# Altium project TSAL_REV1.PrjPCB
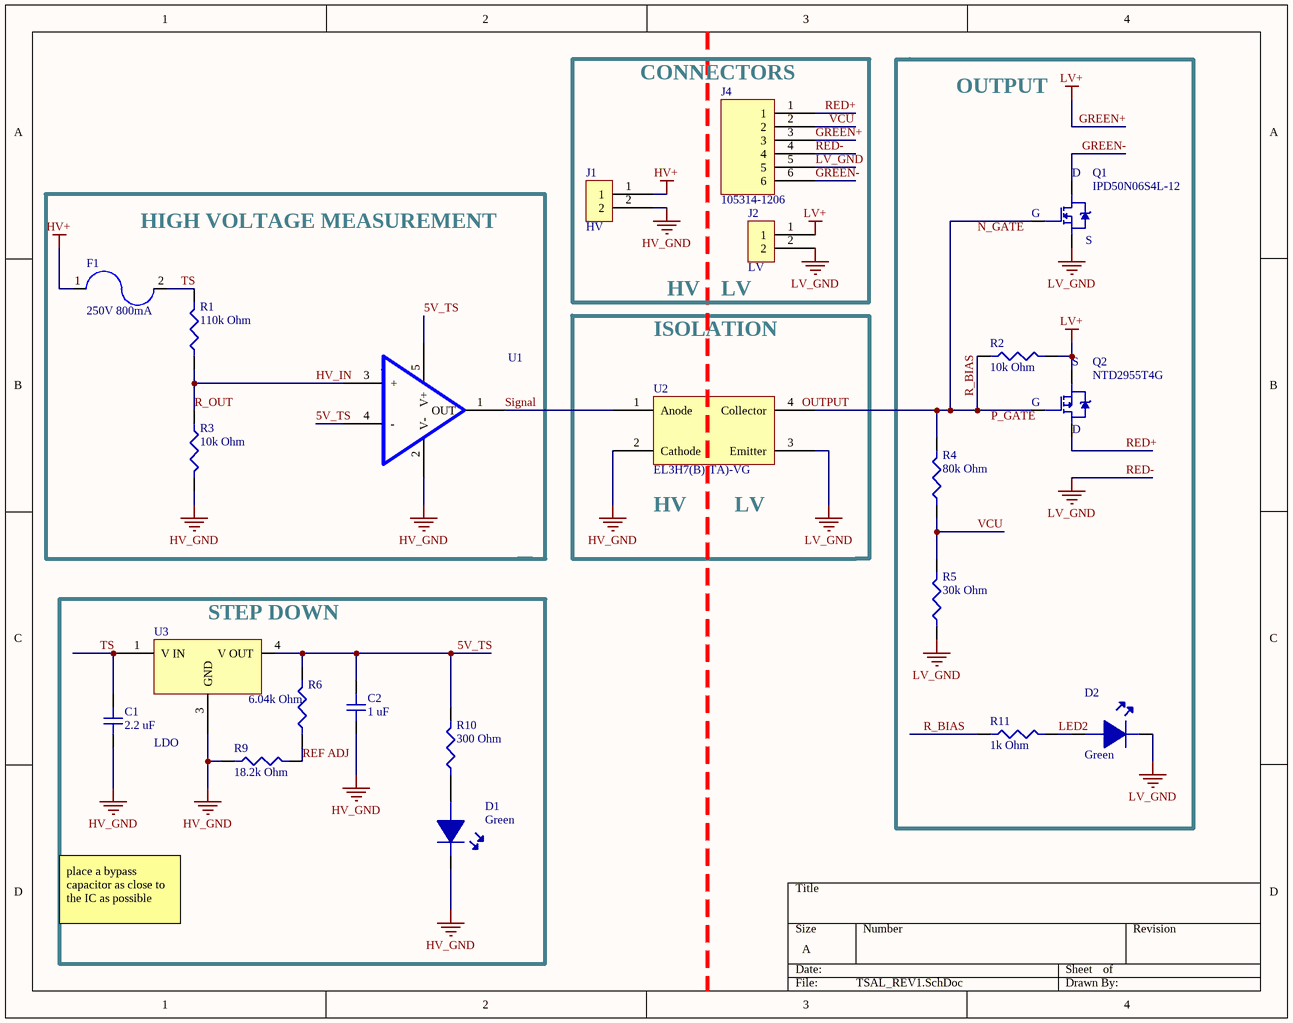
[diagram p0: TSAL_REV1.SchDoc]
1 sheet, 22 parts. Net scope: global (net labels, ports and power ports of the same name join across sheets).
Board file: TSAL_REV1_PCB.PcbDoc

## Sheet TSAL_REV1.SchDoc
size A

### Parts
C1  2.2 uF  [CAPC5850X25N]
C2  1 uF
D1  Green  [LED_0603]
D2  Green  [LED_0603]
F1  250V 800mA  [FUSE_SMD]
J1  HV  [2_PIN_CONNECTOR]
J2  LV  [2_PIN_CONNECTOR]
J4  105314-1206  [*MOLEX_1053141206]
Q1  IPD50N06S4L-12  [DPAK228P998X235-3N]
Q2  NTD2955T4G  [DPAK228P991X238-3N]
R1  110k Ohm  [RESC3116X06N]
R2  10k Ohm  [RESC2012X06N]
R3  10k Ohm  [RESC2012X06N]
R4  80k Ohm  [RESC1608X06N]
R5  30k Ohm  [RESC2012X06N]
R6  6.04k Ohm  [RESC2012X06N]
R9  18.2k Ohm  [RESC2012X06N]
R10  300 Ohm  [RESC1608X06N]
R11  1k Ohm  [RESC1608X06N]
U1  TS861ILT  [SOT95P280X145-5N]  (value not drawn)
U2  EL3H7(B)(TA)-VG  [SOIC127P700X200-4N]
U3  LDO  [DPAK228P991X238-3N]

### Blocks framed on the sheet
OUTPUT: D2 Q1 Q2 R2 R4 R5 R11
STEP DOWN: C1 C2 D1 R6 R9 R10 U3

### Nets
GREEN+: J2.1 J4.3 Q2.4 R2.2  [also labelled LV+]
HV+: F1.1 J1.1
HV_GND: C1.1 C2.1 D1.2 J1.2 R3.2 R9.1 U1.2(V-) U2.2(Cathode) U3.3(GND)
LV_GND: D2.2 J2.2 J4.4 J4.5 Q1.3 R5.1 U2.3(Emitter)  [also labelled RED-]
5V_TS: C2.2 R6.2 R10.2 U1.4(-) U1.5(V+) U3.4(V_OUT)
GREEN-: J4.6 Q1.4
HV_IN: R1.1 R3.1 U1.3(+)  [also labelled R_OUT]
LED2: D2.1 R11.2
R_BIAS: Q1.1 Q2.1 R2.1 R4.2 R11.1 U2.4(Collector)
RED+: J4.1 Q2.3
REF ADJ: R6.1 R9.2
Signal: U1.1(OUT) U2.1(Anode)
TS: C1.2 F1.2 R1.2 U3.1(V_IN)
VCU: J4.2 R4.1 R5.2
NetD1_1: D1.1 R10.1

### Notes on the sheet
- (near J4) CONNECTORS
- HIGH VOLTAGE MEASUREMENT
- HV
- (near J2) LV
- ISOLATION
- (near U2) HV
- (near U2) LV
- place a bypass capacitor as close to the IC as possible
- Labels drawn without touching a wire or pin: N_GATE, OUTPUT, P_GATE
- (in symbol IPD50N06S4L-12) D; G; S
- (in symbol NTD2955T4G) S; G; D

### Library data of the parts
C1 = CGA9P3X7T2E225K250KE: CAP CER 2.2UF 250V X7T 2220; Manufacturer: TDK; Tolerance: 10%; Supplier 1: Digi-Key; Manufacturer Part Number: CGA9P3X7T2E225K250KE; Stock 1: 26264; Pricing 1: 1=4.7, 10=4.227, 100=3.1935 (USD); Mount: Surface Mount; Case/Package: 2220; Weight: 0.016932oz; Case Code (Imperial): 2220; Case Code (Metric): 5750; Min Operating Temperature: -55°C; Max Operating Temperature: 125°C; Capacitance: 2.2uF; Voltage Rating (DC): 250V; Packaging: Tape and Reel; Package Quantity: 1; Voltage Rating: 250V; Dielectric: X7T; Termination: SMD/SMT; Features: Soft Termination; Length: 5.7mm; Height: 2.5mm; Width: 5mm; Thickness: 0.11inch; Depth: 5mm; Ratings: AEC-Q200; REACH SVHC: No SVHC; Lead Free: Lead Free; ComponentLink1URL: http://www.mouser.com/ds/2/400/lcc_commercial_soft_en-775842.pdf?src-supplier=Mouser; ComponentLink1Description: http://www.mouser.com/ds/2/400/lcc_commercial_soft_en-775842.pdf?src-supplier=Mouser; ComponentLink2URL: http://www.farnell.com/datasheets/1839935.pdf?src-supplier=Element14; ComponentLink2Description: http://www.farnell.com/datasheets/1839935.pdf?src-supplier=Element14; Supplier Part Number 1: 445-8766-1-ND
C2 = CL10A105KP8NNNC: Cap Ceramic 1uF 10V X5R 10% SMD 0603 85C Paper T/R; Manufacturer: Samsung; Supplier 1: Digi-Key; Manufacturer Part Number: CL10A105KP8NNNC; Stock 1: 3646234; Pricing 1: 1=0.1, 10=0.036, 100=0.0161, 500=0.01152, 1000=0.00905 (USD); Mount: Surface Mount; Case/Package: 0603; Case Code (Metric): 1608; Case Code (Imperial): 0603; Contact Plating: Tin; Min Operating Temperature: -55°C; Max Operating Temperature: 85°C; Tolerance: 10%; Packaging: Tape and Reel; Package Quantity: 1; Capacitance: 1uF; Voltage Rating: 10V; Dielectric: X5R; Voltage: 10V; Length: 1.6mm; Height: 0.8mm; Width: 0.031inch; Thickness: 0.035inch; Depth: 0.8mm; Radiation Hardening: No; ComponentLink1URL: https://www.verical.com/server-webapp/html/getDatasheet?partID=358616&src-supplier=Verical; ComponentLink1Description: https://www.verical.com/server-webapp/html/getDatasheet?partID=358616&src-supplier=Verical; ComponentLink2URL: http://www1.futureelectronics.com/doc/SAMSUNG%20PASSIVE/CL05B104KQ5NNNC.pdf?src-supplier=Future+Electronics; ComponentLink2Description: http://www1.futureelectronics.com/doc/SAMSUNG%20PASSIVE/CL05B104KQ5NNNC.pdf?src-supplier=Future+Electronics; Supplier Part Number 1: 1276-1182-1-ND
D1 D2 = LTST-C191KGKT: LED Uni-Color Green 574nm 2-Pin Chip LED T/R; Manufacturer: Vishay Lite-On; Lens Color: Colorless; Power Rating: 75mW; Luminous Intensity: 35mcd; Viewing Angle: 130°; Lens Style: Rectangular,Colorless; Forward Current: 30mA; Forward Voltage: 2V; Dominant Wavelength: 571nm; Test Current: 20mA; Lens Transparency: Clear; Number of Elements: 1; Reverse Voltage: 5V; Supplier 1: Digi-Key; Manufacturer Part Number: LTST-C191KGKT; Stock 1: 840932; Pricing 1: 1=0.28, 10=0.201, 100=0.0954, 500=0.06364, 1000=0.04984, 2500=0.04878 (USD); Mount: Surface Mount; Case/Package: 0603; Number of Pins: 2; Color: Green; Case Code (Metric): 1608; Case Code (Imperial): 0603; Min Operating Temperature: -55°C; Max Operating Temperature: 85°C; Packaging: Tape and Reel; Package Quantity: 1; Illumination Color: Green; Power Dissipation: 75mW; Wavelength: 574nm; Number of LEDs: 1; Max Power Dissipation: 75mW; Length: 1.6mm; Height: 0.55mm; Width: 0.8mm; Depth: 0.8mm; Radiation Hardening: No; Lead Free: Lead Free; ComponentLink1URL: http://optoelectronics.liteon.com/upload/download/DS22-2000-228/LTST-C191KGKT.PDF?src-supplier=Digi-Key; ComponentLink1Description: http://optoelectronics.liteon.com/upload/download/DS22-2000-228/LTST-C191KGKT.PDF?src-supplier=Digi-Key; Supplier Part Number 1: 160-1446-1-ND
F1 = 0678D0800-02: Manufacturer: Bel; Fuse Type: Board Mount (Cartridge Style Excluded); Voltage Rating (AC): 350V; DC Cold Resistance: 380mR; Approvals: cURus; Supplier 1: Digi-Key; Manufacturer Part Number: 0678D0800-02; Stock 1: 2000; Pricing 1: 1=1.2, 5=1.164, 10=1.089, 50=0.901, 100=0.7508, 250=0.732, 500=0.61936, 1000=0.54429 (USD); Mount: Surface Mount; Case/Package: SMD/SMT; Min Operating Temperature: -55°C; Max Operating Temperature: 125°C; Packaging: Tape and Reel; Current Rating: 800mA; Voltage Rating (DC): 250V; Supplier Part Number 1: 507-2258-6-ND
J1 J2 = 0705530001: Manufacturer: Molex; Number of Positions: 2; Connector Type: Male Pin; Contact Resistance: 30mR; Pitch: 2.54mm; Supplier 1: Digi-Key; Manufacturer Part Number: 0705530001; Stock 1: 14591; Pricing 1: 1=0.71, 72=0.53486, 144=0.51264, 504=0.44575, 1008=0.36775, 5040=0.32318, 10008=0.30089 (USD); Mount: Through Hole; Color: Black; Housing Color: Black; Housing Material: Polyester; Contact Plating: Gold; Contact Material: Bronze; Min Operating Temperature: -40°C; Max Operating Temperature: 105°C; Number of Rows: 1; Packaging: Rail/Tube; Termination: Solder; Number of Contacts: 2; Orientation: Right Angle; Fastening Type: Latch; Length: 7.37mm; Depth: 13.59mm; Contact Mating Length: 0.24inch; Radiation Hardening: No; ComponentLink1URL: https://www.molex.com/pdm_docs/ps/PS-70400.pdf?src-supplier=Digi-Key; ComponentLink1Description: https://www.molex.com/pdm_docs/ps/PS-70400.pdf?src-supplier=Digi-Key; ComponentLink2URL: http://www.molex.com/webdocs/datasheets/pdf/en-us/0705530001_PCB_HEADERS.pdf?src-supplier=Avnet; ComponentLink2Description: http://www.molex.com/webdocs/datasheets/pdf/en-us/0705530001_PCB_HEADERS.pdf?src-supplier=Avnet; Supplier Part Number 1: WM4900-ND
J4 = 105314-1206: CONN HEADER R/A 6POS 2.5MM; Manufacturer: Molex; Gender: Male; Supplier 1: Digi-Key; Manufacturer Part Number: 105314-1206; Stock 1: 3932; Pricing 1: 1=1.86, 10=1.684, 100=1.4431, 500=1.2026, 1000=1.0308, 5000=0.91398, 10000=0.89336 (USD); Mount: Through Hole; Contact Plating: Gold; Contact Material: Brass; Color: Black; Termination: Through Hole; Number of Rows: 2; REACH SVHC: Unknown; ComponentLink1URL: http://www.farnell.com/datasheets/2221464.pdf?src-supplier=Element14; ComponentLink1Description: http://www.farnell.com/datasheets/2221464.pdf?src-supplier=Element14; ComponentLink2URL: http://www.farnell.com/datasheets/2221464.pdf?src-supplier=Newark; ComponentLink2Description: http://www.farnell.com/datasheets/2221464.pdf?src-supplier=Newark; ComponentLink3URL: http://www.farnell.com/datasheets/2221464.pdf?src-supplier=Farnell; ComponentLink3Description: http://www.farnell.com/datasheets/2221464.pdf?src-supplier=Farnell; ComponentLink4URL: https://www.molex.com/pdm_docs/ps/PS-105300-100-001.pdf?src-supplier=Digi-Key; ComponentLink4Description: https://www.molex.com/pdm_docs/ps/PS-105300-100-001.pdf?src-supplier=Digi-Key; Supplier Part Number 1: WM14977-ND
Q1 = IPD50N06S4L-12: MOSFET N-CH 60V 50A TO252-3-11; Manufacturer: Infineon; Rise Time: 2ns; Input Capacitance: 2.89nF; Rds On Max: 12mR; Max Power Dissipation: 50W; Turn-On Delay Time: 6ns; Turn-Off Delay Time: 25ns; Fall Time: 5ns; Drain to Source Resistance: 21.6mR; Element Configuration: Single; Gate to Source Voltage (Vgs): 16V; Supplier 1: Digi-Key; Manufacturer Part Number: IPD50N06S4L-12; Stock 1: 0; Pricing 1: 1=0.78, 10=0.689, 100=0.5268, 500=0.41736, 1000=0.33429 (USD); Case/Package: TO-252-3; Number of Pins: 3; Min Operating Temperature: -55°C; Max Operating Temperature: 175°C; Package Quantity: 2500; Packaging: Tape and Reel; Max Dual Supply Voltage: 60V; Drain to Source Voltage (Vdss): 60V; Continuous Drain Current (ID): 50A; Length: 6.5mm; Height: 2.3mm; Width: 6.22mm; Halogen Free: Halogen Free; Lead Free: Lead Free; ComponentLink1URL: http://www.infineon.com/dgdl/Infineon-IPD50N06S4L_12-DS-v01_00-en.pdf?folderId=db3a30431a5c32f2011a8084a04a6500&fileId=db3a30431ff9881501203885cc580ca0&ack=t&src-supplier=Digi-Key; ComponentLink1Description: http://www.infineon.com/dgdl/Infineon-IPD50N06S4L_12-DS-v01_00-en.pdf?folderId=db3a30431a5c32f2011a8084a04a6500&fileId=db3a30431ff9881501203885cc580ca0&ack=t&src-supplier=Digi-Key; Supplier Part Number 1: IPD50N06S4L12ATMA1CT-ND
Q2 = NTD2955T4G: Trans MOSFET P-CH 60V 12A 3-Pin(2+Tab) DPAK T/R; Manufacturer: ON Semiconductor; Rise Time: 45ns; Nominal Vgs: -2.8V; Input Capacitance: 750pF; Max Power Dissipation: 55W; Number of Elements: 1; Rds On Max: 180mR; Fall Time: 48ns; Drain to Source Resistance: 155mR; Turn-Off Delay Time: 26ns; Drain to Source Voltage (Vdss): -60V; Turn-On Delay Time: 10ns; Element Configuration: Single; Gate to Source Voltage (Vgs): 20V; Current Rating: -12A; Supplier 1: Digi-Key; Manufacturer Part Number: NTD2955T4G; Stock 1: 44767; Pricing 1: 1=1.04, 10=0.912, 100=0.7036, 500=0.52118, 1000=0.41694 (USD); Case/Package: DPAK; Number of Pins: 3; Contact Plating: Matte,Tin; Min Operating Temperature: -55°C; Max Operating Temperature: 175°C; Package Quantity: 1; Packaging: Tape and Reel; Power Dissipation: 55W; Continuous Drain Current (ID): 12A; Threshold Voltage: -2.8V; Drain to Source Breakdown Voltage: -60V; Voltage Rating (DC): -60V; On-State Resistance: 180mR; Number of Channels: 1; Length: 6.73mm; Height: 2.38mm; Width: 6.22mm; Radiation Hardening: No; REACH SVHC: No SVHC; Lead Free: Lead Free; ComponentLink1URL: http://www.onsemi.com/pub/Collateral/NTD2955-D.PDF?src-supplier=Avnet; ComponentLink1Description: http://www.onsemi.com/pub/Collateral/NTD2955-D.PDF?src-supplier=Avnet; ComponentLink2URL: http://www.onsemi.com/pub/Collateral/NTD2955-D.PDF?src-supplier=Avnet+Europe; ComponentLink2Description: http://www.onsemi.com/pub/Collateral/NTD2955-D.PDF?src-supplier=Avnet+Europe; ComponentLink3URL: http://www.onsemi.com/pub_link/Collateral/NTD2955-D.PDF?src-supplier=Element14; ComponentLink3Description: http://www.onsemi.com/pub_link/Collateral/NTD2955-D.PDF?src-supplier=Element14; ComponentLink4URL: http://www.onsemi.com/pub/Collateral/NTD2955-D.PDF?src-supplier=Digi-Key; ComponentLink4Description: http://www.onsemi.com/pub/Collateral/NTD2955-D.PDF?src-supplier=Digi-Key; ComponentLink5URL: http://www.jameco.com/Jameco/Products/ProdDS/1178118.pdf?src-supplier=Jameco; ComponentLink5Description: http://www.jameco.com/Jameco/Products/ProdDS/1178118.pdf?src-supplier=Jameco; Supplier Part Number 1: NTD2955T4GOSCT-ND
R1 = RC1206FR-07110KL: RES SMD 110K OHM 1% 1/4W 1206; Manufacturer: Yageo; Resistance: 110kR; Power Rating: 250mW; Temperature Coefficient: 100ppm/°C; Voltage Rating (DC): 200V; Supplier 1: Digi-Key; Manufacturer Part Number: RC1206FR-07110KL; Stock 1: 78364; Pricing 1: 1=0.1, 10=0.071, 100=0.0291, 1000=0.01306, 2500=0.01134 (USD); Mount: Surface Mount; Case/Package: 1206; Case Code (Metric): 3216; Case Code (Imperial): 1206; Min Operating Temperature: -55°C; Max Operating Temperature: 155°C; Tolerance: 1%; Packaging: Tape and Reel; Package Quantity: 1; Voltage Rating: 200V; Composition: Thick Film; Number of Terminations: 2; Termination: SMD/SMT; Military Standard: Not; Max Power Dissipation: 250mW; Features: Moisture Resistant; Length: 3.1mm; Height: 0.55mm; Width: 0.063inch; Depth: 1.6mm; Lead Free: Lead Free; ComponentLink1URL: http://www.yageo.com.tw/exep/pages/download/literatures/PYu-R_INT-thick_7.pdf?src-supplier=Digi-Key; ComponentLink1Description: http://www.yageo.com.tw/exep/pages/download/literatures/PYu-R_INT-thick_7.pdf?src-supplier=Digi-Key; ComponentLink2URL: http://www.yageo.com/documents/recent/PYu-RC_Group_51_RoHS_L_9.pdf?src-supplier=Digi-Key; ComponentLink2Description: http://www.yageo.com/documents/recent/PYu-RC_Group_51_RoHS_L_9.pdf?src-supplier=Digi-Key; ComponentLink3URL: http://documents.rs-components.com/techlib://itc_doclist_GB.htm?stockno=6182344&src-supplier=RSComponents; ComponentLink3Description: http://documents.rs-components.com/techlib://itc_doclist_GB.htm?stockno=6182344&src-supplier=RSComponents; ComponentLink4URL: http://www.yageo.com/documents/recent/PYu-RC1206_51_RoHS_L-4.pdf?src-supplier=Future+Electronics; ComponentLink4Description: http://www.yageo.com/documents/recent/PYu-RC1206_51_RoHS_L-4.pdf?src-supplier=Future+Electronics; Supplier Part Number 1: 311-110KFRCT-ND
R2 R3 = RNCP0805FTD10K0: RES 10K OHM 1% 1/4W 0805; Manufacturer: Stackpole Electronics; Resistance: 10kR; Max Power Dissipation: 250mW; Temperature Coefficient: 100ppm/°C; Supplier 1: Digi-Key; Manufacturer Part Number: RNCP0805FTD10K0; Stock 1: 152624; Pricing 1: 1=0.1, 10=0.072, 100=0.0277, 1000=0.0122, 2500=0.01053 (USD); Mount: Surface Mount; Case/Package: 0805; Case Code (Metric): 2012; Case Code (Imperial): 0805; Min Operating Temperature: -55°C; Max Operating Temperature: 155°C; Tolerance: 1%; Packaging: Tape and Reel; Composition: Thin Film; Number of Terminations: 2; Features: Moisture Resistant,Anti-Sulfur; Length: 0.079inch; Height: 0.024inch; Width: 0.049inch; Lead Free: Lead Free; ComponentLink1URL: https://www.seielect.com/catalog/SEI-Packaging.pdf?src-supplier=Digi-Key; ComponentLink1Description: https://www.seielect.com/catalog/SEI-Packaging.pdf?src-supplier=Digi-Key; Supplier Part Number 1: RNCP0805FTD10K0CT-ND
R4 = PTN0603E8002BST1: RES 80K OHM 0.1% 0.15W 0603; Manufacturer: Vishay Dale; Resistance: 80kR; Power Rating: 150mW; Temperature Coefficient: 25ppm/°C; Operating Supply Voltage: 75V; Supplier 1: Digi-Key; Manufacturer Part Number: PTN0603E8002BST1; Stock 1: 12027; Pricing 1: 1=0.69, 10=0.578, 100=0.3878 (USD); Mount: Surface Mount; Case/Package: 0603; Contact Plating: Copper,Tin,Silver; Min Operating Temperature: -55°C; Max Operating Temperature: 125°C; Packaging: Tape and Reel; Tolerance: 0.1%; Composition: Thin Film; Length: 1.63mm; Height: 508um; Width: 813um; Thickness: 508um; Radiation Hardening: No; Lead Free: Lead Free; ComponentLink1URL: http://www.vishay.com/docs/60026/ptn.pdf?src-supplier=Avnet; ComponentLink1Description: http://www.vishay.com/docs/60026/ptn.pdf?src-supplier=Avnet; ComponentLink2URL: http://www.vishay.com/docs/60026/ptn.pdf?src-supplier=Avnet+Asia; ComponentLink2Description: http://www.vishay.com/docs/60026/ptn.pdf?src-supplier=Avnet+Asia; ComponentLink3URL: http://www.vishay.com/docs/60026/ptn.pdf?src-supplier=Digi-Key; ComponentLink3Description: http://www.vishay.com/docs/60026/ptn.pdf?src-supplier=Digi-Key; Supplier Part Number 1: 764-1457-1-ND
R5 = CRG0805F30K: Thick Film Resistors CRG0805 1% 30K; Manufacturer: TE Connectivity; Resistance: 30kR; Temperature Coefficient: 100ppm/°C; Power Rating: 125mW; Voltage Rating: 150V; Number of Resistors: 1; Supplier 1: Digi-Key; Manufacturer Part Number: CRG0805F30K; Stock 1: 39608; Pricing 1: 1=0.1, 10=0.049, 100=0.02, 1000=0.00898, 2500=0.0078 (USD); Mount: Surface Mount; Case/Package: 0805; Weight: 0.000194oz; Case Code (Imperial): 0805; Case Code (Metric): 2012; Min Operating Temperature: -55°C; Max Operating Temperature: 125°C; Packaging: Tape and Reel; Tolerance: 1%; Composition: Thick Film; Package Quantity: 5000; Number of Terminations: 2; Termination: Solder; Length: 2mm; Height: 0.55mm; Width: 1.25mm; ELV: Compliant; Supplier Part Number 1: A126360CT-ND
R6 = RR1220P-6041-D-M: RES SMD 6.04KOHM 0.5% 1/10W 0805; Manufacturer: Susumu; Resistance: 6.04kR; Power Rating: 100mW; Voltage Rating: 100V; Temperature Coefficient: 25ppm/°C; Supplier 1: Digi-Key; Manufacturer Part Number: RR1220P-6041-D-M; Stock 1: 40354; Pricing 1: 1=0.11, 10=0.098, 100=0.0376, 1000=0.01654, 2500=0.01428 (USD); Case/Package: 0805; Number of Pins: 2; Case Code (Imperial): 0805; Case Code (Metric): 2012; Min Operating Temperature: -55°C; Max Operating Temperature: 125°C; Tolerance: 0.5%; Packaging: Tape and Reel; Termination: SMD/SMT; Composition: Thin Film; Voltage Rating (DC): 100V; Length: 2mm; Height: 0.4mm; Width: 1.25mm; Lead Free: Lead Free; REACH SVHC: No SVHC; Supplier Part Number 1: RR12P6.04KDCT-ND
R9 = ERA-6AEB1822V: Panasonic ERA Series Thin Film Surface Mount Resistor 0805 Case 18.2k 0.1% 0.125W 25ppm/C; Resistance: 18.2kR; Power Rating: 125mW; Voltage Rating: 100V; Temperature Coefficient: 25ppm/°C; Supplier 1: Digi-Key; Manufacturer: Panasonic; Manufacturer Part Number: ERA-6AEB1822V; Stock 1: 8429; Pricing 1: 1=0.36, 10=0.302, 100=0.1182, 1000=0.04948, 2500=0.04536 (USD); Mount: Surface Mount; Case/Package: 0805; Number of Pins: 2; Case Code (Imperial): 0805; Case Code (Metric): 2012; Contact Plating: Tin; Min Operating Temperature: -55°C; Max Operating Temperature: 155°C; Tolerance: 0.1%; Packaging: Tape and Reel; Composition: Metal Film,Thin Film; Package Quantity: 5000; Number of Terminations: 2; Military Standard: Not; Termination: Solder; Max Power Dissipation: 125mW; Voltage Rating (DC): 100V; Features: Automotive AEC-Q200; Length: 2mm; Height: 0.5mm; Width: 1.25mm; Depth: 1.25mm; Radiation Hardening: No; REACH SVHC: No SVHC; Lead Free: Lead Free; ComponentLink1URL: http://www.farnell.com/datasheets/485442.pdf?src-supplier=Farnell; ComponentLink1Description: http://www.farnell.com/datasheets/485442.pdf?src-supplier=Farnell; ComponentLink2URL: http://www.mouser.com/ds/2/315/AOA0000C237-1100991.pdf?src-supplier=Mouser; ComponentLink2Description: http://www.mouser.com/ds/2/315/AOA0000C237-1100991.pdf?src-supplier=Mouser; ComponentLink3URL: http://www.farnell.com/datasheets/485442.pdf?src-supplier=Element14; ComponentLink3Description: http://www.farnell.com/datasheets/485442.pdf?src-supplier=Element14; ComponentLink4URL: http://uk.rs-online.com/webdocs/0eb1/0900766b80eb1d8c.pdf?src-supplier=RSComponents; ComponentLink4Description: http://uk.rs-online.com/webdocs/0eb1/0900766b80eb1d8c.pdf?src-supplier=RSComponents; ComponentLink5URL: https://produktinfo.conrad.com/datenblaetter/450000-474999/458878-da-01-en-WIDERSTAND_0805_ERA.pdf?src-supplier=Conrad; ComponentLink5Description: https://produktinfo.conrad.com/datenblaetter/450000-474999/458878-da-01-en-WIDERSTAND_0805_ERA.pdf?src-supplier=Conrad; Supplier Part Number 1: P18.2KDACT-ND
R10 = RR0816P-301-D: RES SMD 300 OHM 0.5% 1/16W 0603; Manufacturer: Susumu; Resistance: 300R; Power Rating: 63mW; Voltage Rating: 75V; Temperature Coefficient: 25ppm/°C; Supplier 1: Digi-Key; Manufacturer Part Number: RR0816P-301-D; Stock 1: 26864; Pricing 1: 1=0.11, 10=0.098, 100=0.0376, 1000=0.01654, 2500=0.01428 (USD); Case/Package: 0603; Number of Pins: 2; Case Code (Imperial): 0603; Case Code (Metric): 1608; Min Operating Temperature: -55°C; Max Operating Temperature: 125°C; Packaging: Tape and Reel; Tolerance: 0.5%; Package Quantity: 5000; Termination: SMD/SMT; Composition: Thin Film; Number of Terminations: 2; Max Power Dissipation: 63mW; Voltage Rating (DC): 75V; Length: 1.6mm; Height: 0.4mm; Width: 0.8mm; Depth: 0.8mm; REACH SVHC: Unknown; Lead Free: Lead Free; ComponentLink1URL: http://www.susumu.co.jp/common/pdf/n_catalog_partition05_en.pdf?src-supplier=Digi-Key; ComponentLink1Description: http://www.susumu.co.jp/common/pdf/n_catalog_partition05_en.pdf?src-supplier=Digi-Key; Supplier Part Number 1: RR08P300DCT-ND
R11 = RC0603JR-071KL: RES SMD 1K OHM 5% 1/10W 0603; Manufacturer: Yageo; Power Rating: 100mW; Resistance: 1kR; Voltage Rating: 50V; Temperature Coefficient: 100ppm/°C; Supplier 1: Digi-Key; Manufacturer Part Number: RC0603JR-071KL; Stock 1: 11328493; Pricing 1: 1=0.1, 10=0.019, 100=0.0077, 1000=0.00347, 2500=0.00301 (USD); Case/Package: 0603; Number of Pins: 2; Case Code (Imperial): 0603; Case Code (Metric): 1608; Contact Plating: Tin,Matte; Min Operating Temperature: -55°C; Max Operating Temperature: 155°C; Packaging: Tape and Reel; Tolerance: 5%; Voltage Rating (DC): 50V; Termination: SMD/SMT; Composition: Thick Film; Military Standard: Not; Package Quantity: 5000; Length: 1.6mm; Height: 0.45mm; Width: 0.8mm; Depth: 0.8mm; Radiation Hardening: No; REACH SVHC: Unknown; Lead Free: Lead Free; ComponentLink1URL: http://www.yageo.com/documents/recent/PYu-RC_Group_51_RoHS_L_2.pdf?src-supplier=Avnet; ComponentLink1Description: http://www.yageo.com/documents/recent/PYu-RC_Group_51_RoHS_L_2.pdf?src-supplier=Avnet; ComponentLink2URL: http://www.farnell.com/datasheets/2167052.pdf?src-supplier=Element14; ComponentLink2Description: http://www.farnell.com/datasheets/2167052.pdf?src-supplier=Element14; ComponentLink3URL: http://www.farnell.com/datasheets/443971.pdf?src-supplier=Element14; ComponentLink3Description: http://www.farnell.com/datasheets/443971.pdf?src-supplier=Element14; ComponentLink4URL: http://www.farnell.com/datasheets/1868787.pdf?src-supplier=Element14; ComponentLink4Description: http://www.farnell.com/datasheets/1868787.pdf?src-supplier=Element14; Supplier Part Number 1: 311-1.0KGRCT-ND
U1 = TS861ILT: COMPARATOR, MICROPWR, P PULL, 5; Manufacturer: STMicroelectronics; Voltage Gain: 240dB; Min Supply Voltage: 2.7V; Max Supply Voltage: 10V; Number of Channels: 1; Max Power Dissipation: 500mW; Nominal Supply Current: 14uA; Common Mode Rejection Ratio: 70dB; Input Offset Voltage (Vos): 15mV; Input Bias Current: 300pA; Quiescent Current: 16uA; Propagation Delay: 2us; Max Supply Current: 12uA; Output Current per Channel: 5mA; Response Time: 500ns; Power Supply Rejection Ratio (PSRR): 80dB; Supplier 1: Digi-Key; Manufacturer Part Number: TS861ILT; Stock 1: 15426; Pricing 1: 1=0.8, 10=0.703, 25=0.6604, 100=0.5006, 250=0.426, 500=0.4047, 1000=0.30885 (USD); Mount: Surface Mount; Case/Package: SOT-23; Number of Pins: 5; Min Operating Temperature: -40°C; Max Operating Temperature: 85°C; Package Quantity: 3000; Number of Elements: 1; Packaging: Tape and Reel; Max Input Current: 300pA; Power Dissipation: 500mW; Output Current: 5mA; Type: General Purpose; Radiation Hardening: No; REACH SVHC: No SVHC; Lead Free: Lead Free; ComponentLink1URL: http://www.farnell.com/datasheets/1690531.pdf?src-supplier=Element14; ComponentLink1Description: http://www.farnell.com/datasheets/1690531.pdf?src-supplier=Element14; ComponentLink2URL: http://www.st.com/content/ccc/resource/technical/document/datasheet/dd/d1/7d/d5/d5/ce/49/c5/CD00001705.pdf/files/CD00001705.pdf/jcr:content/translations/en.CD00001705.pdf?src-supplier=Digi-Key; ComponentLink2Description: http://www.st.com/content/ccc/resource/technical/document/datasheet/dd/d1/7d/d5/d5/ce/49/c5/CD00001705.pdf/files/CD00001705.pdf/jcr:content/translations/en.CD00001705.pdf?src-supplier=Digi-Key; ComponentLink3URL: http://www.mouser.com/ds/2/389/ts861-957384.pdf?src-supplier=Mouser; ComponentLink3Description: http://www.mouser.com/ds/2/389/ts861-957384.pdf?src-supplier=Mouser; ComponentLink4URL: https://www.verical.com/server-webapp/html/getDatasheet?partID=160028&src-supplier=Verical; ComponentLink4Description: https://www.verical.com/server-webapp/html/getDatasheet?partID=160028&src-supplier=Verical; ComponentLink5URL: http://www.produktinfo.conrad.com/datenblaetter/1100000-1199999/001185659-da-01-en-IC_COMPARATOR_R_R_TS861ILT_SOT_23_5_STM.pdf?src-supplier=Conrad; ComponentLink5Description: http://www.produktinfo.conrad.com/datenblaetter/1100000-1199999/001185659-da-01-en-IC_COMPARATOR_R_R_TS861ILT_SOT_23_5_STM.pdf?src-supplier=Conrad; Supplier Part Number 1: 497-6777-1-ND
U2 = EL3H7(B)(TA)-VG: OPTOISOLATOR 3.75KV TRANS 4-SSOP; Manufacturer: Everlight; Number of Channels: 1; Collector Emitter Voltage (VCEO): 80V; Max Power Dissipation: 200mW; Forward Current: 50mA; Forward Voltage: 1.4V; Reverse Breakdown Voltage: 6V; Rise Time: 18000ns; Collector Emitter Saturation Voltage: 200mV; Current Transfer Ratio: 260%; Approvals: UL; Supplier 1: Digi-Key; Manufacturer Part Number: EL3H7(B)(TA)-VG; Stock 1: 119652; Pricing 1: 1=0.42, 10=0.304, 25=0.248, 100=0.1985, 250=0.16752, 500=0.1427, 1000=0.11167, 2500=0.10237 (USD); Mount: Surface Mount; Case/Package: SSOP; Number of Pins: 4; Min Operating Temperature: -55°C; Max Operating Temperature: 125°C; Packaging: Tape and Reel; Package Quantity: 1; Max Output Voltage: 80V; Output Current per Channel: 50mA; Max Input Current: 50mA; Max Collector Current: 50mA; Fall Time: 18000ns; Isolation Voltage: 3.75kV; Number of Elements: 1; Power Dissipation: 200mW; Collector Emitter Breakdown Voltage: 80V; Radiation Hardening: No; Lead Free: Lead Free; ComponentLink1URL: https://everlightamericas.com/index.php?controller=attachment&id_attachment=2584&src-supplier=Digi-Key; ComponentLink1Description: https://everlightamericas.com/index.php?controller=attachment&id_attachment=2584&src-supplier=Digi-Key; ComponentLink2URL: https://everlightamericas.com/index.php?controller=attachment&amp;id_attachment=2584&src-supplier=Digi-Key; ComponentLink2Description: https://everlightamericas.com/index.php?controller=attachment&amp;id_attachment=2584&src-supplier=Digi-Key; ComponentLink3URL: https://www.verical.com/server-webapp/html/getDatasheet?partID=416716&src-supplier=Verical; ComponentLink3Description: https://www.verical.com/server-webapp/html/getDatasheet?partID=416716&src-supplier=Verical; Supplier Part Number 1: 1080-1197-6-ND
U3 = LR8K4-G: Standard Regulator Pos 1.2V to 440V 0.01A 3-Pin(2+Tab) TO-252; Manufacturer: Microchip; Max Power Dissipation: 2.5W; Max Input Voltage: 450V; Min Input Voltage: 13.2V; Number of Outputs: 1; Polarity: Positive; Output Current: 20mA; Accuracy: 5%; Power Supply Rejection Ratio (PSRR): 60dB; Output Type: Adjustable; Max Output Current: 10mA; Min Current Limit: 30mA; Dropout Voltage: 450mV; Supplier 1: Digi-Key; Manufacturer Part Number: LR8K4-G; Stock 1: 11899; Pricing 1: 1=0.93, 25=0.78, 100=0.71 (USD); Mount: Surface Mount; Case/Package: TO-252-3; Number of Pins: 3; Contact Plating: Tin,Matte; Min Operating Temperature: -40°C; Max Operating Temperature: 85°C; Output Voltage: 440V; Packaging: Cut Tape; Package Quantity: 2000; Number of Regulators: 1; Min Output Voltage: 1.2V; Max Output Voltage: 440V; Length: 6.73mm; Height: 2.39mm; Width: 6.1mm; Radiation Hardening: No; REACH SVHC: No SVHC; Lead Free: Lead Free; ComponentLink1URL: http://www.farnell.com/datasheets/1849628.pdf?src-supplier=Element14; ComponentLink1Description: http://www.farnell.com/datasheets/1849628.pdf?src-supplier=Element14; Supplier Part Number 1: LR8K4-GCT-ND